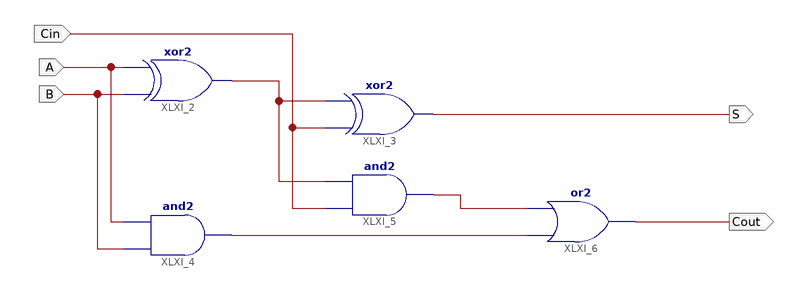
[diagram p0: schematic sheet 1]
// Xilinx ISE schematic fulladder.sch (spartan6) as structural Verilog: 5 symbols, 5 ports
module fulladder (
  input  Cin,
  input  A,
  input  B,
  output S,
  output Cout
);

  wire XLXN_2, XLXN_3, XLXN_10;

  xor XLXI_2 (XLXN_10, B, A);
  xor XLXI_3 (S, Cin, XLXN_10);
  and XLXI_4 (XLXN_2, B, A);
  and XLXI_5 (XLXN_3, Cin, XLXN_10);
  or XLXI_6 (Cout, XLXN_2, XLXN_3);
endmodule
